# Altium schematic sheet KMT1-42.CPU rev.2.0.0.SchDoc
size A2; Organization: Altium Limited; Address1: L3, 12a Rodborough Rd; Address2: Frenchs Forest; Address3: NSW; Address4: Australia 2086
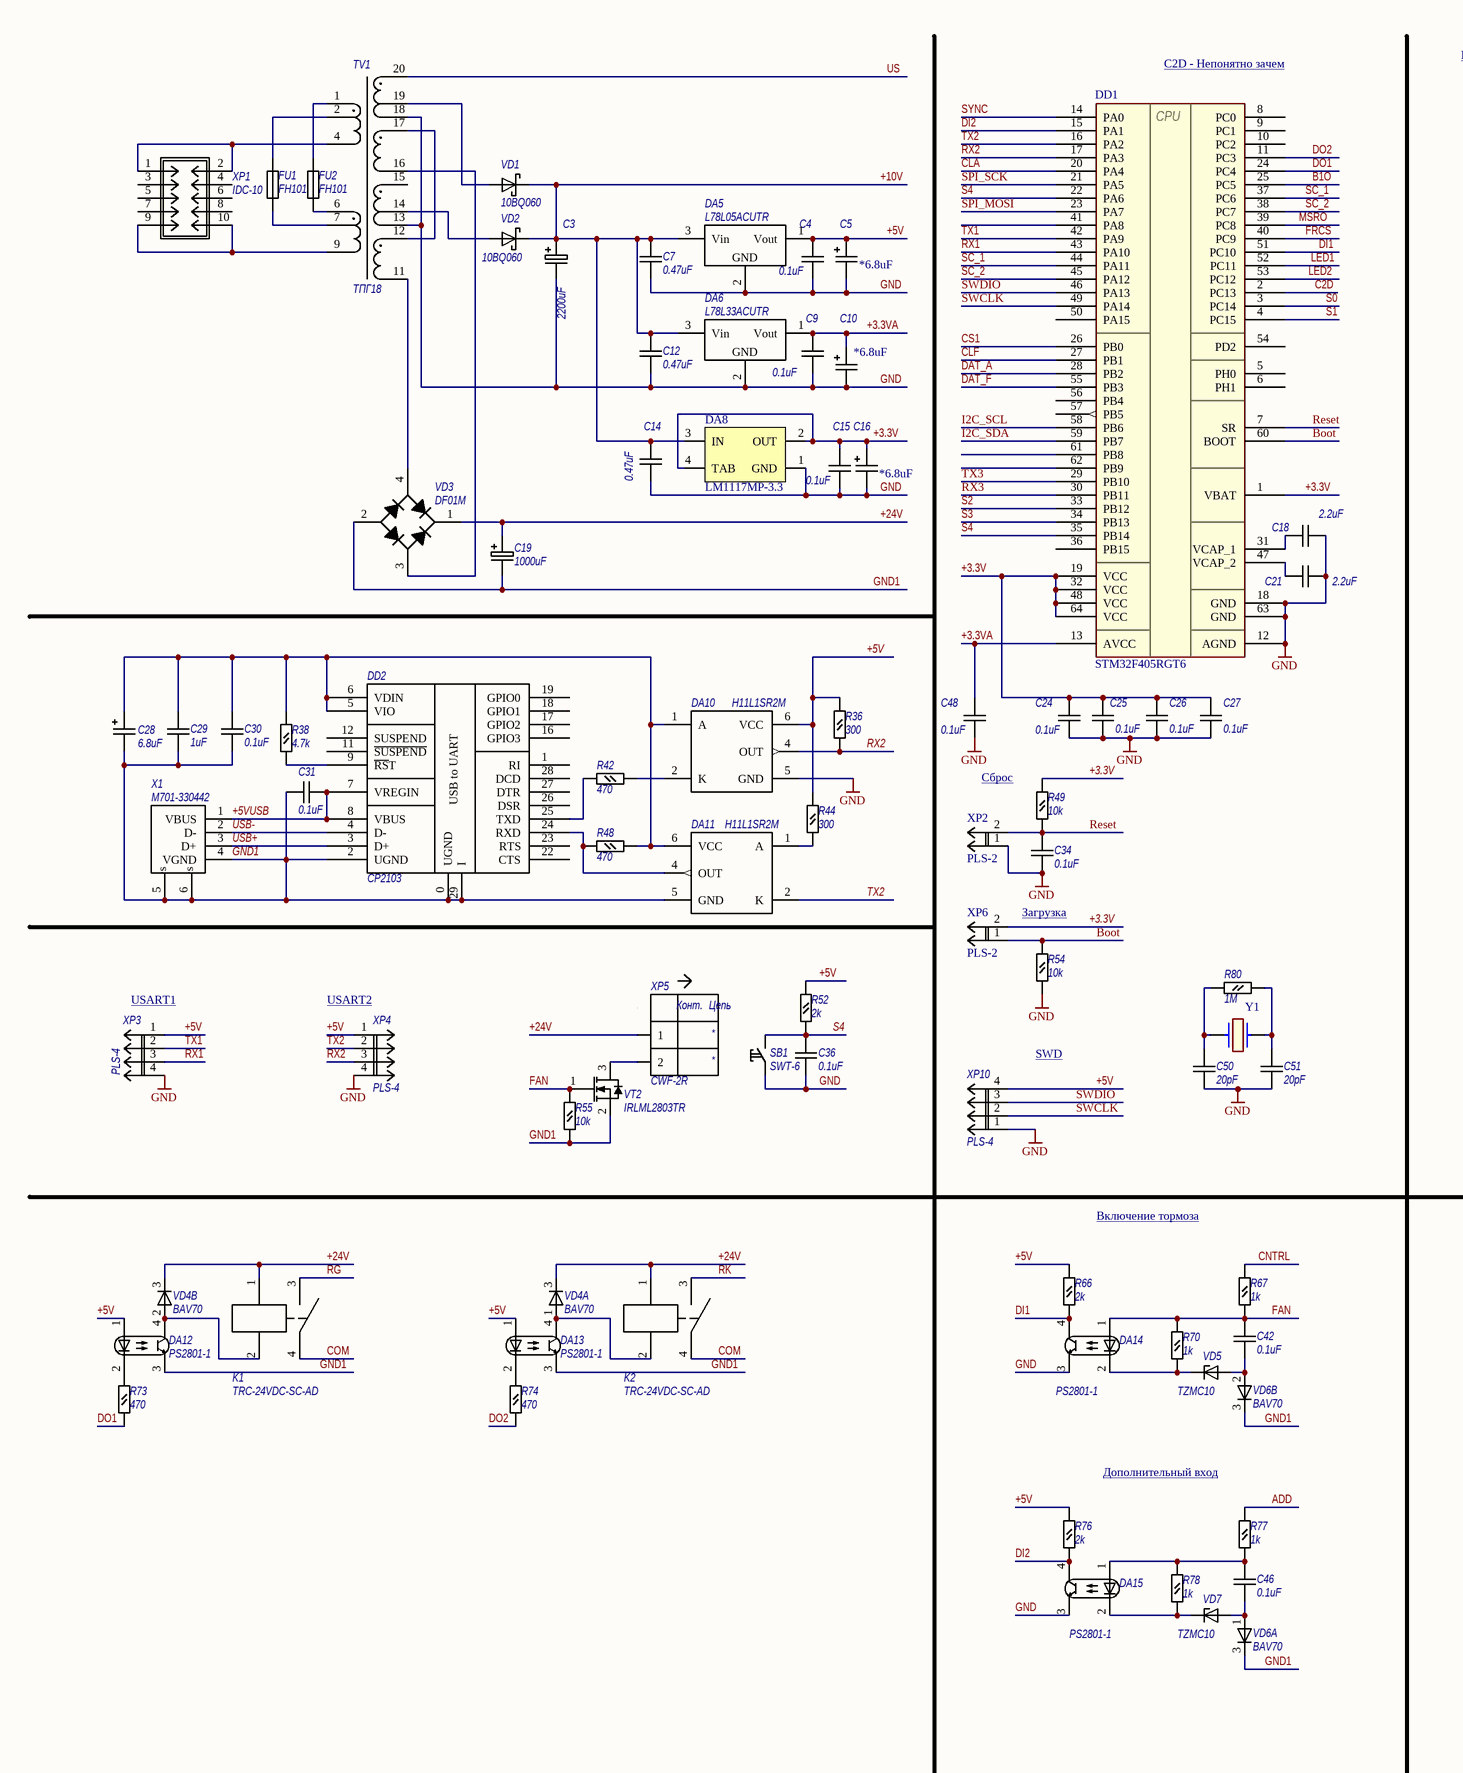
[diagram p0: KMT1-42.CPU rev.2.0.0.SchDoc, left]
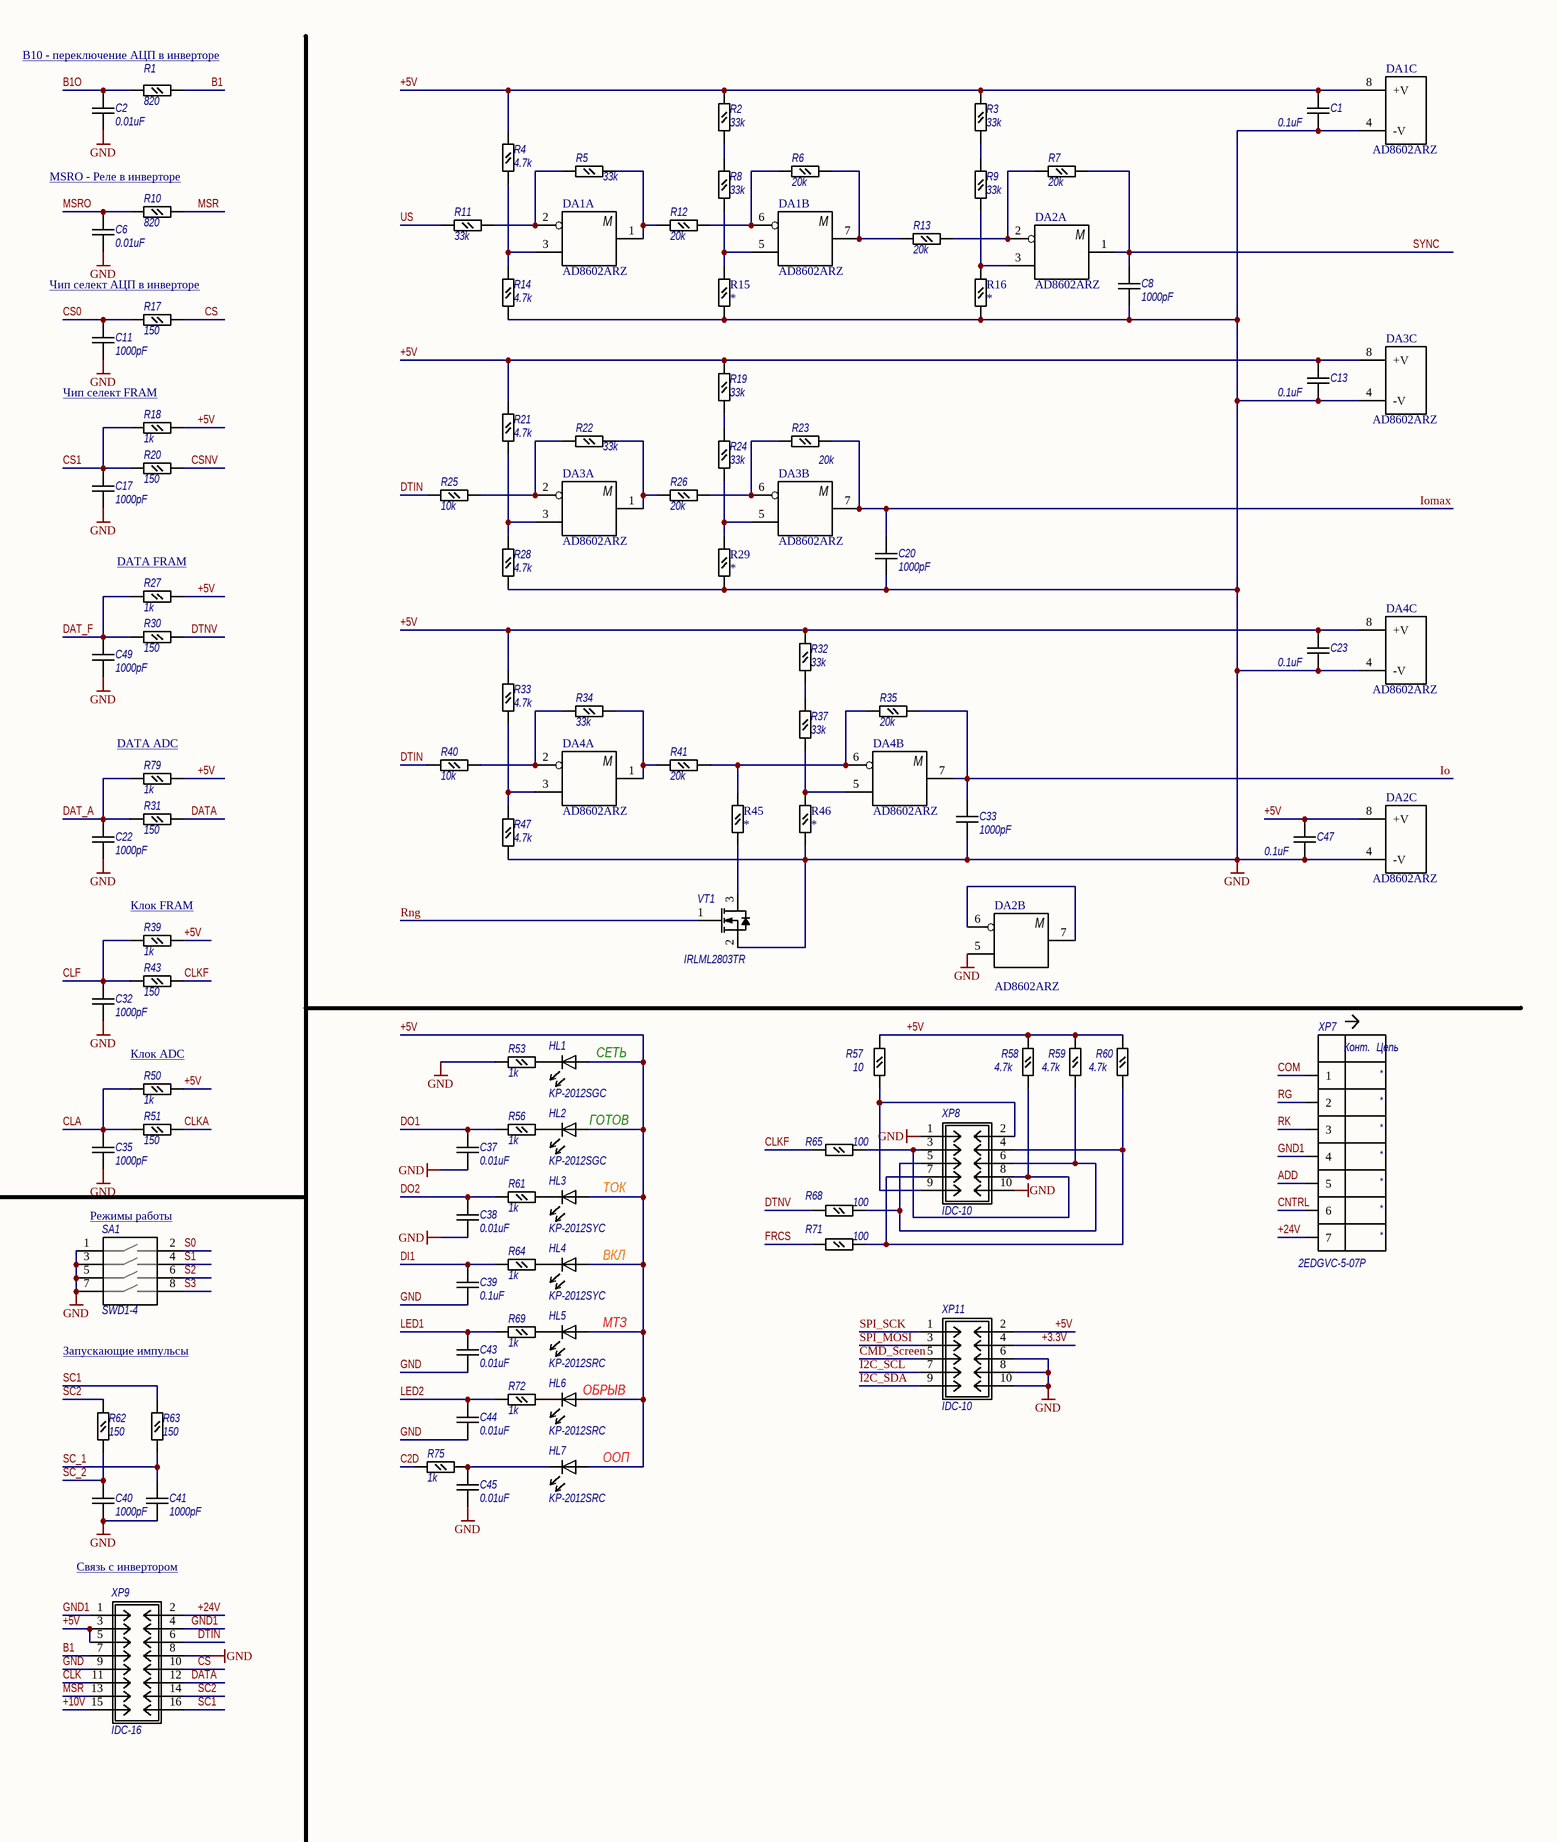
[diagram p1: KMT1-42.CPU rev.2.0.0.SchDoc, right]

## Parts
C1  0.1uF  [cap0805]
C2  0.01uF  [cap0805]
C3  2200uF  [ECR-EHR 13mm]
C4  0.1uF  [cap0805]
C5  *6.8uF  [TC3216-1206-A]
C6  0.01uF  [cap0805]
C7  0.47uF  [cap0805]
C8  1000pF  [cap0805]
C9  0.1uF  [cap0805]
C10  *6.8uF  [TC3216-1206-A]
C11  1000pF  [cap0805]
C12  0.47uF  [cap0805]
C13  0.1uF  [cap0805]
C14  0.47uF  [cap0805]
C15  0.1uF  [cap0805]
C16  *6.8uF  [TC3216-1206-A]
C17  1000pF  [cap0805]
C18  2.2uF  [cap0805]
C19  1000uF  [ECR-EHR 13mm]
C20  1000pF  [cap0805]
C21  2.2uF  [cap0805]
C22  1000pF  [cap0805]
C23  0.1uF  [cap0805]
C24  0.1uF  [cap0805]
C25  0.1uF  [cap0805]
C26  0.1uF  [cap0805]
C27  0.1uF  [cap0805]
C28  6.8uF  [TC3216-1206-A]
C29  1uF  [cap0805]
C30  0.1uF  [cap0805]
C31  0.1uF  [cap0805]
C32  1000pF  [cap0805]
C33  1000pF  [cap0805]
C34  0.1uF  [cap0805]
C35  1000pF  [cap0805]
C36  0.1uF  [cap0805]
C37  0.01uF  [cap0805]
C38  0.01uF  [cap0805]
C39  0.1uF  [cap0805]
C40  1000pF  [cap0805]
C41  1000pF  [cap0805]
C42  0.1uF  [cap0805]
C43  0.01uF  [cap0805]
C44  0.01uF  [cap0805]
C45  0.01uF  [cap0805]
C46  0.1uF  [cap0805]
C47  0.1uF  [cap0805]
C48  0.1uF  [cap0805]
C49  1000pF  [cap0805]
C50  20pF  [cap0805]
C51  20pF  [cap0805]
DA1  AD8602ARZ  [SO-8]  (parts A,B,C of 3)
DA2  AD8602ARZ  [SO-8]  (parts A,B,C of 3)
DA3  AD8602ARZ  [SO-8]  (parts A,B,C of 3)
DA4  AD8602ARZ  [SO-8]  (parts A,B,C of 3)
DA5  L78L05ACUTR  [SOT89]
DA6  L78L33ACUTR  [SOT89]
DA8  LM1117MP-3.3  [SOT223]
DA10  H11L1SR2M  [PDIP6]
DA11  H11L1SR2M  [PDIP6]
DA12  PS2801-1  [SOP4]
DA13  PS2801-1  [SOP4]
DA14  PS2801-1  [SOP4]
DA15  PS2801-1  [SOP4]
DD1  STM32F405RGT6  [LQFP64]
DD2  CP2103  [QFN-28]
FU1  FH101  [FH101]
FU2  FH101  [FH101]
HL1  KP-2012SGC  [Led0805]
HL2  KP-2012SGC  [Led0805]
HL3  KP-2012SYC  [Led0805]
HL4  KP-2012SYC  [Led0805]
HL5  KP-2012SRC  [Led0805]
HL6  KP-2012SRC  [Led0805]
HL7  KP-2012SRC  [Led0805]
K1  TRC-24VDC-SC-AD  [TRC-24VDC-SC-AD]
K2  TRC-24VDC-SC-AD  [TRC-24VDC-SC-AD]
R1  820  [res0805]
R2  33k  [res0805]
R3  33k  [res0805]
R4  4.7k  [res0805]
R5  33k  [res0805]
R6  20k  [res0805]
R7  20k  [res0805]
R8  33k  [res0805]
R9  33k  [res0805]
R10  820  [res0805]
R11  33k  [res0805]
R12  20k  [res0805]
R13  20k  [res0805]
R14  4.7k  [res0805]
R15  *  [res0805]
R16  *  [res0805]
R17  150  [res0805]
R18  1k  [res0805]
R19  33k  [res0805]
R20  150  [res0805]
R21  4.7k  [res0805]
R22  33k  [res0805]
R23  20k  [res0805]
R24  33k  [res0805]
R25  10k  [res0805]
R26  20k  [res0805]
R27  1k  [res0805]
R28  4.7k  [res0805]
R29  *  [res0805]
R30  150  [res0805]
R31  150  [res0805]
R32  33k  [res0805]
R33  4.7k  [res0805]
R34  33k  [res0805]
R35  20k  [res0805]
R36  300  [res0805]
R37  33k  [res0805]
R38  4.7k  [res0805]
R39  1k  [res0805]
R40  10k  [res0805]
R41  20k  [res0805]
R42  470  [res0805]
R43  150  [res0805]
R44  300  [res0805]
R45  *  [res0805]
R46  *  [res0805]
R47  4.7k  [res0805]
R48  470  [res0805]
R49  10k  [res0805]
R50  1k  [res0805]
R51  150  [res0805]
R52  2k  [res0805]
R53  1k  [res0805]
R54  10k  [res0805]
R55  10k  [res0805]
R56  1k  [res0805]
R57  10  [res0805]
R58  4.7k  [res0805]
R59  4.7k  [res0805]
R60  4.7k  [res0805]
R61  1k  [res0805]
R62  150  [res0805]
R63  150  [res0805]
R64  1k  [res0805]
R65  100  [res0805]
R66  2k  [res0805]
R67  1k  [res0805]
R68  100  [res0805]
R69  1k  [res0805]
R70  1k  [res0805]
R71  100  [res0805]
R72  1k  [res0805]
R73  470  [res0805]
R74  470  [res0805]
R75  1k  [res0805]
R76  2k  [res0805]
R77  1k  [res0805]
R78  1k  [res0805]
R79  1k  [res0805]
R80  1M  [res0805]
SA1  SWD1-4  [SWD1-4]
SB1  SWT-6  [SWT-6]
TV1  ТПГ18  [TPG18]
VD1  10BQ060  [SMB]
VD2  10BQ060  [SMB]
VD3  DF01M  [DF-M]
VD4  BAV70  [SOT23]  (parts A,B of 2)
VD5  TZMC10  [SOD80]
VD6  BAV70  [SOT23]  (parts A,B of 2)
VD7  TZMC10  [SOD80]
VT1  IRLML2803TR  [SOT23]
VT2  IRLML2803TR  [SOT23]
X1  M701-330442  [USB_Bvert]
XP1  IDC-10  [IDC-10]
XP2  PLS-2  [PLS2]
XP3  PLS-4  [PLS4]
XP4  PLS-4  [PLS4]
XP5  CWF-2R  [CWF-2R]
XP6  PLS-2  [PLS2]
XP7  2EDGVC-5-07P  [2EDGVC-5.0-7P-2]
XP8  IDC-10  [IDC-10]
XP9  IDC-16  [IDC-16]
XP10  PLS-4  [PLS4]
XP11  IDC-10  [IDC-10]
Y1  8 MHz  [XT49M]  (value not drawn)

## Nets
GND: C1.1 C2.1 C3.2 C4.1 C5.2 C6.1 C7.1 C8.1 C9.1 C10.2 C11.1 C12.1 C13.1 C14.1 C15.1 C16.2 C17.1 C18.1 C20.1 C21.1 C22.1 C23.1 C24.1 C25.1 C26.1 C27.1 C32.1 C33.1 C34.1 C35.1 C36.1 C37.2 C38.2 C39.2 C40.1 C41.1 C43.2 C44.2 C45.2 C47.1 C48.1 C49.1 C50.2 C51.2 DA1.4(-V) DA2.4(-V) DA2.5(IN+) DA3.4(-V) DA4.4(-V) DA5.0(GND) DA5.2(GND) DA6.0(GND) DA6.2(GND) DA8.1(GND) DA10.5(GND) DA14.3(EMITTER) DA15.3(EMITTER) DD1.12(AGND) DD1.18(GND) DD1.63(GND) R14.2 R15.1 R16.1 R28.2 R29.1 R46.1 R47.2 R53.2 R54.1 SA1.1 SA1.3 SA1.5 SA1.7 SB1.1 TV1.13 TV1.18 VT1.2(D) XP2.1 XP3.4 XP4.4 XP8.1 XP8.10 XP9.8 XP9.9 XP10.1 XP11.6 XP11.8 XP11.10
VDIN: DD2.10(VDIN) DD2.13(VDIN) DD2.14(VDIN) DD2.15(VDIN) DD2.20(VDIN) DD2.21(VDIN)
+3.3V: C15.2 C16.1 C24.2 C25.2 C26.2 C27.2 DA8.2(OUT) DA8.4(TAB) DD1.1(VBAT) DD1.19(VCC) DD1.32(VCC) DD1.48(VCC) DD1.64(VCC) R49.2 XP6.2 XP11.4
+3.3VA: C9.2 C10.1 C48.2 DA6.1(Vout) DD1.13(AVCC)
+5V: C1.2 C4.2 C5.1 C13.2 C23.2 C47.2 DA1.8(+V) DA2.8(+V) DA3.8(+V) DA4.8(+V) DA5.1(Vout) DA10.6(VCC) DA12.1(A) DA13.1(A) HL1.1(A) HL2.1(A) HL3.1(A) HL4.1(A) HL5.1(A) HL6.1(A) HL7.1(A) R2.1 R3.1 R4.1 R18.2 R19.1 R21.1 R27.2 R32.1 R33.1 R36.2 R39.2 R44.2 R50.2 R52.2 R57.1 R58.1 R59.1 R60.1 R66.2 R76.2 R79.2 XP3.1 XP4.1 XP9.3 XP9.5 XP10.4 XP11.2
+5VUSB: C31.2 DD2.7(VREGIN) DD2.8(VBUS) X1.1(VBUS)
+10V: C3.1 C7.2 C12.2 C14.2 DA5.3(Vin) DA6.3(Vin) DA8.3(IN) VD1.2(K) VD2.2(K) XP9.15
+24V: C19.1 K1.1 K2.1 VD3.1(K) VD4.3(K) XP5.1 XP7.7 XP9.2
ADD: R77.2 XP7.5
B1: R1.1 XP9.7
B1O: C2.2 DD1.25(PC5) R1.2
Boot: DD1.60(BOOT) R54.2 XP6.1
C2D: DD1.2(PC13) R75.2
CLA: C35.2 DD1.20(PA4) R50.1 R51.2
CLF: C32.2 DD1.27(PB1) R39.1 R43.2
CLK: XP9.11
CLKA: R51.1
CLKF: R43.1 R65.1
CMD_Screen: XP11.5
CNTRL: R67.2 XP7.6
COM: K1.4 K2.4 XP7.1
CS: R17.1 XP9.10
CS0: C11.2 R17.2
CS1: C17.2 DD1.26(PB0) R18.1 R20.2
CSNV: R20.1
DAT_A: C22.2 DD1.28(PB2) R31.2 R79.1
DAT_F: C49.2 DD1.55(PB3) R27.1 R30.2
DATA: R31.1 XP9.12
DI1: C39.1 DA14.4(COLLECTOR) DD1.51(PC10) R64.2 R66.1
DI2: DA15.4(COLLECTOR) DD1.15(PA1) R76.1
DO1: C37.1 DD1.24(PC4) R56.2 R73.1
DO2: C38.1 DD1.11(PC3) R61.2 R74.1
DTIN: R25.2 R40.2 XP9.6
DTNV: R30.1 R68.1
FAN: C42.2 DA14.1(A) R55.2 R67.1 R70.2 VT2.1(G)
FRCS: DD1.40(PC9) R71.1
GND1: C19.2 C28.2 C29.1 C30.1 C31.1 DA11.5(GND) DA12.3(EMITTER) DA13.3(EMITTER) DD2.0(UGND) DD2.2(UGND) DD2.29(I) R55.1 VD3.2(A) VD6.3(K) VT2.2(D) X1.4(VGND) X1.5(s) X1.6(s) XP7.4 XP9.1 XP9.4
I2C_SCL: DD1.58(PB6) XP11.7
I2C_SDA: DD1.59(PB7) XP11.9
Io: C33.2 DA4.7(OUT) R35.1
Iomax: C20.2 DA3.7(OUT) R23.1
LED1: C43.1 DD1.52(PC11) R69.2
LED2: C44.1 DD1.53(PC12) R72.2
MSR: R10.1 XP9.13
MSRO: C6.2 DD1.39(PC8) R10.2
Reset: C34.2 DD1.7(SR) R49.1 XP2.2
RG: K1.3 XP7.2
RK: K2.3 XP7.3
Rng: VT1.1(G)
RX1: DD1.43(PA10) XP3.3
RX2: DA10.4(OUT) DD1.17(PA3) R36.1 XP4.3
RX3: DD1.30(PB11)
S0: DD1.3(PC14) SA1.2
S1: DD1.4(PC15) SA1.4
S2: DD1.33(PB12) SA1.6
S3: DD1.34(PB13) SA1.8
S4: C36.2 DD1.22(PA6) DD1.35(PB14) R52.1 SB1.2
SC1: R63.1 XP9.16
SC2: R62.1 XP9.14
SC_1: C41.2 DD1.37(PC6) DD1.44(PA11) R63.2
SC_2: C40.2 DD1.38(PC7) DD1.45(PA12) R62.2
SPI_MOSI: DD1.23(PA7) XP11.3
SPI_SCK: DD1.21(PA5) XP11.1
SWCLK: DD1.49(PA14) XP10.2
SWDIO: DD1.46(PA13) XP10.3
SYNC: C8.2 DA2.1(OUT) DD1.14(PA0) R7.1
TX1: DD1.42(PA9) XP3.2
TX2: DA11.2(K) DD1.16(PA2) XP4.2
TX3: DD1.29(PB10)
US: R11.1 TV1.20
USB+: DD2.3(D+) X1.3(D+)
USB-: DD2.4(D-) X1.2(D-)
NetC18_2: C18.2 DD1.31(VCAP_1)
NetC21_2: C21.2 DD1.47(VCAP_2)
NetC28_1: C28.1 C29.2 C30.2 DA10.1(A) DA11.6(VCC) DD2.5(VIO) DD2.6(VDIN) R38.2 R48.2
NetC42_1: C42.1 VD5.1(A) VD6.2(A2)
NetC45_1: C45.1 HL7.2(K) R75.1
NetC46_1: C46.1 VD6.1(A1) VD7.1(A)
NetC46_2: C46.2 DA15.1(A) R77.1 R78.2
NetC50_1: C50.1 R80.2 Y1.2(L2)
NetC51_1: C51.1 R80.1 Y1.1(L1)
NetDA1_1: DA1.1(OUT) R5.1 R12.2
NetDA1_2: DA1.2(IN-) R5.2 R11.2
NetDA1_3: DA1.3(IN+) R4.2 R14.1
NetDA1_5: DA1.5(IN+) R8.2 R15.2
NetDA1_6: DA1.6(IN-) R6.2 R12.1
NetDA1_7: DA1.7(OUT) R6.1 R13.2
NetDA2_2: DA2.2(IN-) R7.2 R13.1
NetDA2_3: DA2.3(IN+) R9.2 R16.2
NetDA2_6: DA2.6(IN-) DA2.7(OUT)
NetDA3_1: DA3.1(OUT) R22.1 R26.2
NetDA3_2: DA3.2(IN-) R22.2 R25.1
NetDA3_3: DA3.3(IN+) R21.2 R28.1
NetDA3_5: DA3.5(IN+) R24.2 R29.2
NetDA3_6: DA3.6(IN-) R23.2 R26.1
NetDA4_1: DA4.1(OUT) R34.1 R41.2
NetDA4_2: DA4.2(IN-) R34.2 R40.1
NetDA4_3: DA4.3(IN+) R33.2 R47.1
NetDA4_5: DA4.5(IN+) R37.2 R46.2
NetDA4_6: DA4.6(IN-) R35.2 R41.1 R45.2
NetDA10_2: DA10.2(K) R42.2
NetDA11_1: DA11.1(A) R44.1
NetDA11_4: DA11.4(OUT) DD2.24(RXD) R48.1
NetDA12_2: DA12.2(K) R73.2
NetDA12_4: DA12.4(COLLECTOR) K1.2 VD4.2(A2)
NetDA13_2: DA13.2(K) R74.2
NetDA13_4: DA13.4(COLLECTOR) K2.2 VD4.1(A1)
NetDA14_2: DA14.2(K) R70.1 VD5.2(K)
NetDA15_2: DA15.2(K) R78.1 VD7.2(K)
NetDD2_9: DD2.9(~{RS}T) R38.1
NetDD2_25: DD2.25(TXD) R42.1
NetFU1_1: FU1.1 TV1.7
NetFU1_2: FU1.2 TV1.2
NetFU2_1: FU2.1 TV1.6
NetFU2_2: FU2.2 TV1.1
NetHL1_2: HL1.2(K) R53.1
NetHL2_2: HL2.2(K) R56.1
NetHL3_2: HL3.2(K) R61.1
NetHL4_2: HL4.2(K) R64.1
NetHL5_2: HL5.2(K) R69.1
NetHL6_2: HL6.2(K) R72.1
NetR2_2: R2.2 R8.1
NetR3_2: R3.2 R9.1
NetR19_2: R19.2 R24.1
NetR32_2: R32.2 R37.1
NetR45_1: R45.1 VT1.3(S)
NetR57_2: R57.2 XP8.2 XP8.9
NetR58_2: R58.2 R65.2 XP8.3 XP8.8
NetR59_2: R59.2 R68.2 XP8.5 XP8.6
NetR60_2: R60.2 R71.2 XP8.4 XP8.7
NetTV1_4: TV1.4 XP1.1 XP1.2
NetTV1_9: TV1.9 XP1.9 XP1.10
NetTV1_11: TV1.11 VD3.4(C)
NetTV1_12: TV1.12 TV1.17
NetTV1_14: TV1.14 VD2.1(A)
NetTV1_16: TV1.16 VD3.3(C)
NetTV1_19: TV1.19 VD1.1(A)
NetVT2_3: VT2.3(S) XP5.2

Not connected (* = marked no-connect by the designer): DD1 5(PH0) 6(PH1) 8(PC0) 9(PC1) 10(PC2) 36(PB15) 41(PA8) 50(PA15) 54(PD2) 56(PB4) 57(PB5) 61(PB8) 62(PB9); DD2 1(RI) 11(~{SUSPEND}) 12(SUSPEND) 16(GPIO3) 17(GPIO2) 18(GPIO1) 19(GPIO0) 22(CTS) 23(RTS) 26(DSR) 27(DTR) 28(DCD); TV1 15; XP1 3 4 5 6 7 8

## Notes on the sheet
- (near DD1) C2D - Непонятно зачем
- B10 - переключение АЦП в инверторе
- MSRO - Реле в инверторе
- Чип селект АЦП в инверторе
- Чип селект FRAM
- (near R27) DATA FRAM
- Сброс
- (near R79) DATA ADC
- Загрузка
- (near R39) Клок FRAM
- (near XP3) USART1
- (near XP4) USART2
- SWD
- (near R50) Клок ADC
- (near HL1) СЕТЬ
- (near HL2) ГОТОВ
- (near HL3) ТОК
- Включение тормоза
- (near SA1) Режимы работы
- (near HL4) ВКЛ
- (near HL5) МТЗ
- Запускающие импульсы
- (near HL6) ОБРЫВ
- (near HL7) ООП
- Дополнительный вход
- Связь с инвертором
- Title
- Size:
- Date:
- File:
- A2
- Number:
- Time:
- Revision:
- Sheet
- of
- (in symbol 2EDGVC-5-07P) Конт.; Цепь
- (in symbol AD8602ARZ, part A) M
- (in symbol AD8602ARZ, part B) M
- (in symbol CP2103) USB to UART
- (in symbol CWF-2R) Конт.; Цепь
- (in symbol STM32F405RGT6) CPU

## Library data of the parts
C1 C2 C4 C6-C9 C11-C15 C17 C18 C20-C27 C29-C51 = cap0805: Керамический конденсатор, SMD; Group: Конденсаторы; Tolerance: X7R; Voltage: 25V; NPads: 2; Part Number: cap0805; SType: SMD; Package: SMD 0805
  C1 C4 C9 C13 C15 C23-C27 C30 C31 C34 C36 C39 C42 C46-C48: ValueSCH: 0.1uF
  C2 C6 C37 C38 C43-C45: ValueSCH: 0.01uF
  C7 C12 C14: ValueSCH: 0.47uF
  C8 C11 C17 C20 C22 C32 C33 C35 C40 C41 C49: ValueSCH: 1000pF
  C18 C21: ValueSCH: 2.2uF
  C29: ValueSCH: 1uF
  C50 C51: ValueSCH: 20pF
C3 = ECR/EHR/EXR D=13mm: Алюминиевый конденсатор Hitano; Group: Конденсаторы; SType: TH; Voltage: 16V; NPads: 2; Part Number: ECR/EHR/EXR D=13mm; ValueSCH: 2200uF; Package: ECR/HER
C5 C10 C16 = capA: Танталовый конденсатор, SMD; Part Number: capA; Group: Конденсаторы; NPads: 2; ValueSCH: *6.8uF; SType: SMD; Package: SMD A
C19 = ECR/EHR/EXR D=13mm: Алюминиевый конденсатор Hitano; Group: Конденсаторы; SType: TH; Voltage: 35V; NPads: 2; Part Number: ECR/EHR/EXR D=13mm; ValueSCH: 1000uF; Package: ECR/HER
C28 = capA: Танталовый конденсатор, SMD; Part Number: capA; Group: Конденсаторы; Voltage: 6.3V; NPads: 2; ValueSCH: 6.8uF; SType: SMD; Package: SMD A
DA1-DA4 = AD8602ARZ: Операционный усилитель 2 в 1; Group: Микросхемы; SType: SMD; NPads: 8; Part Number: AD8602ARZ; ValueSCH: AD8602ARZ; Package: SO-8
DA5 = L78L05ACUTR: Линейный стабилизатор 5V; Group: Микросхемы; SType: SMD; NPads: 4; Part Number: L78L05ACUTR; ValueSCH: L78L05ACUTR; Package: SOT89
DA6 = L78L33ACUTR: Линейный стабилизатор 3.3V; Group: Микросхемы; SType: SMD; NPads: 4; Part Number: L78L33ACUTR; ValueSCH: L78L33ACUTR; Package: SOT89
DA8 = LM1117MP-3.3: Линейный стабилизатор 3.3V; Group: Микросхемы; SType: SMD; Analog: SPX1117M3L-3.3; NPads: 4; Part Number: LM1117MP-3.3; ValueSCH: LM1117MP-3.3; Package: SOT223; HelpURL: \DATA\LM1117.pdf
DA10 DA11 = H11L1SR2M: Оптопара 1 Мбит; Group: Микросхемы; SType: SMD; NPads: 6; Part Number: H11L1SR2M; ValueSCH: H11L1SR2M; Package: PDIP-6
DA12-DA15 = PS2801-1: Оптопара; Group: Микросхемы; SType: SMD; NPads: 4; Part Number: PS2801-1; ValueSCH: PS2801-1; Package: SOP4
DD1 = STM32F405RGT6: Микроконтроллер 32 бит CORTEX M4; Group: Микросхемы; SType: SMD; NPads: 64; Part Number: STM32F405RGT6; ValueSCH: STM32F405RGT6; Package: LQFP64
DD2 = CP2103: Чип USB -> UART; Group: Микросхемы; SType: SMD; NPads: 28; Part Number: CP2103; ValueSCH: CP2103; Package: QFN-28
FU1 FU2 = FH101: Держатель для предохранителей 250В 5А; SType: TH; NPads: 2; Part Number: FH101; ValueSCH: FH101; Group: Держатель для предохранителей
HL1 HL2 = KP-2012SGC: SMD светодиод зеленый; Group: Диоды; NPads: 2; Part Number: KP-2012SGC; ValueSCH: KP-2012SGC; SType: SMD; Package: SMD 0805
HL3 HL4 = KP-2012SYC: SMD светодиод желтый; Group: Диоды; NPads: 2; Part Number: KP-2012SYC; ValueSCH: KP-2012SYC; SType: SMD; Package: SMD 0805
HL5-HL7 = KP-2012SRC: SMD светодиод красный; Group: Диоды; NPads: 2; Part Number: KP-2012SRC; ValueSCH: KP-2012SRC; SType: SMD; Package: SMD 0805
K1 K2 = TRC-24VDC-SC-AD: Реле электромагнитное 24В 10А, 1 контакт (SPST); Group: Переключатели; SType: TH; NPads: 4; Part Number: TRC-24VDC-SC-AD; ValueSCH: TRC-24VDC-SC-AD
R1-R80 = res0805: Резистор 0.125 W, SMD; Group: Резисторы; NPads: 2; Part Number: res0805; SType: SMD; Package: SMD 0805
  R1 R10: ValueSCH: 820
  R2 R3 R5 R8 R9 R11 R19 R22 R24 R32 R34 R37: ValueSCH: 33k
  R4 R14 R21 R28 R33 R38 R47 R58-R60: ValueSCH: 4.7k
  R6 R7 R12 R13 R23 R26 R35 R41: ValueSCH: 20k
  R15 R16 R29 R45 R46: ValueSCH: *
  R17 R20 R30 R31 R43 R51 R62 R63: ValueSCH: 150
  R18 R27 R39 R50 R53 R56 R61 R64 R67 R69 R70 R72 R75 R77-R79: ValueSCH: 1k
  R25 R40 R49 R54 R55: ValueSCH: 10k
  R36 R44: ValueSCH: 300
  R42 R48 R73 R74: ValueSCH: 470
  R52 R66 R76: ValueSCH: 2k
  R57: ValueSCH: 10
  R65 R68 R71: ValueSCH: 100
  R80: ValueSCH: 1M
SA1 = SWD1-4: DIP - переключатель 4 шт.; Group: Переключатели; SType: TH; NPads: 8; Part Number: SWD1-4; ValueSCH: SWD1-4
SB1 = SWT-6: Кнопка тактовая 6 мм х 6 мм х 8мм; Group: Контакторы; SType: TH; NPads: 4; Part Number: SWT-6; ValueSCH: SWT-6
TV1 = ТПГ18: Трансформатор ТПГ-18Вт; Group: Трансформаторы; SType: TH; NPads: 20; Part Number: ТПГ18; ValueSCH: ТПГ18
VD1 VD2 = 10BQ060: Диод шоттки 60V 1A; Group: Диоды; SType: SMD; NPads: 2; Part Number: 10BQ060; ValueSCH: 10BQ060; Package: SMB
VD3 = DF01M: Диодный мост 100V 1A; Group: Диоды; SType: TH; NPads: 4; Part Number: DF01M; ValueSCH: DF01M; Package: DF-M
VD4 VD6 = BAV70: Диодная сборка 2 в 1; Group: Диоды; SType: SMD; NPads: 3; Part Number: BAV70; ValueSCH: BAV70; Package: SOT23-3
VD5 VD7 = TZMC13: Стабилитрон 10V; Group: Диоды; SType: SMD; NPads: 2; Part Number: TZMC10; ValueSCH: TZMC10; Package: SOD80
VT1 VT2 = IRLML2803TR: N-канальный MOSFET 30В 1.2А; Group: Транзисторы; SType: SMD; NPads: 3; Part Number: IRLML2803TR; ValueSCH: IRLML2803TR; Package: SOT23
X1 = M701-330442: Разъём USB-B вертикальный; Group: Разъемы; SType: TH; NPads: 6; Part Number: M701-330442; ValueSCH: M701-330442
XP1 XP8 XP11 = IDC-10: Вилка на плату 5х2 контактов шаг 2.54мм; Group: Разъемы; SType: TH; NPads: 10; Part Number: IDC-10; ValueSCH: IDC-10
XP2 XP6 = PLS-2: Однорядный штыревой разъем 2 шаг 2.54мм; Group: Разъемы; SType: TH; NPads: 2; ValueSCH: PLS-2; Part Number: PLS-2
XP3 XP4 XP10 = PLS-4: Однорядный штыревой разъем 4 шаг 2.54мм; Group: Разъемы; SType: TH; NPads: 4; Part Number: PLS-4; ValueSCH: PLS-4
XP5 = CWF-2R: Вилка на плату 2.50мм угловая закрытая; Group: Разъемы; SType: TH; Analog: DS1069-2MR; NPads: 2; VariantName1: *; VariantName2: *; Part Number: CWF-2R; ValueSCH: CWF-2R
XP7 = 2EDGVC-5-07P: Вилка на плату 7 конт. шаг 5мм; Group: Разъемы; SType: TH; NPads: 7; VariantName1: *; VariantName2: *; VariantName3: *; VariantName4: *; VariantName5: *; VariantName6: *; VariantName7: *; Part Number: 2EDGVC-5-07P; ValueSCH: 2EDGVC-5-07P
XP9 = IDC-16: Вилка на плату 8х2 контактов шаг 2.54мм; Group: Разъемы; SType: TH; NPads: 16; Part Number: IDC-16; ValueSCH: IDC-16
Y1 = XT49M: Кварцевый осциллятор; Group: Резонаторы; SType: SMD; NPads: 2; Part Number: XT49M; ValueSCH: 8 MHz; HelpURL: \DATA\XT49M.pdf